# EAGLE schematic wifiaudiolink (EAGLE 9.7.0)
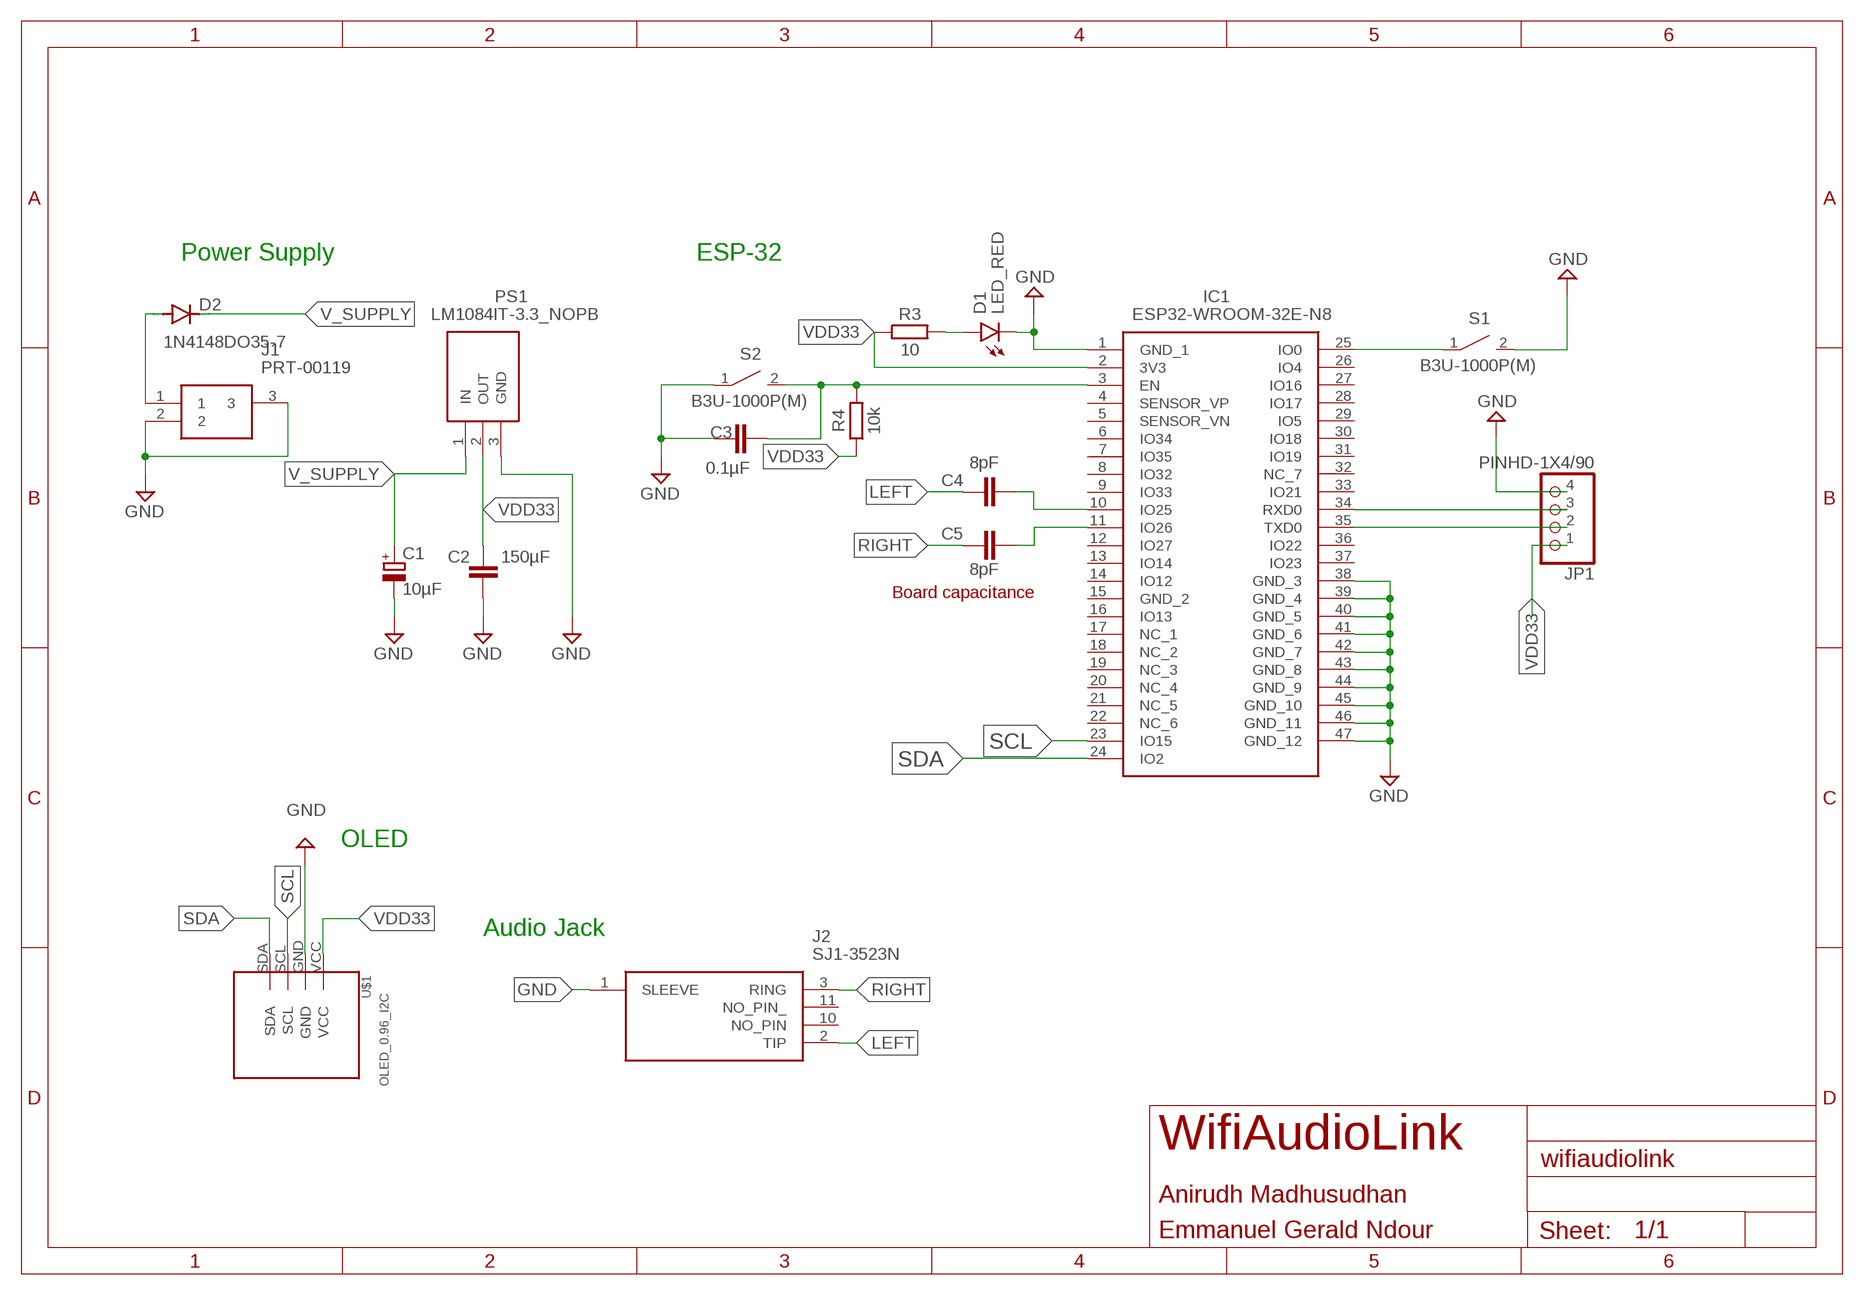
[diagram p0: schematic, sheet 1]

## Parts
C1  10µF  C-POL_RADIAL-11MM-DIA  [CAPPRD508W65D1000H1100B]
C2  150µF  C_RADIAL-12.5MM-DIA  [CAPRD550W60D1025H1250B]
C3  0.1µF  C_CHIP-1812(4532-METRIC)  [CAPC4532X135]
C4  8pF  C_RADIAL-55.5MM-DIA  [CAPRD2261W240D5080H5555B]
C5  8pF  C_RADIAL-55.5MM-DIA  [CAPRD2261W240D5080H5555B]
D1  LED_RED  CHIP-FLAT-R_1206  [LEDC3216X75N_FLAT-R]
D2  1N4148DO35-7  [DO35-7]
IC1  ESP32-WROOM-32E-N8  [ESP32WROOM32EN8]
J1  PRT-00119  [PRT00119]
J2  SJ1-3523N  [SJ13523N]
JP1  PINHD-1X4/90  [1X04/90]
PS1  LM1084IT-3.3_NOPB  [TO254P470X1028X1955-3P]
R3  10  R_CHIP-1206(3216-METRIC)  [RESC3216X70]
R4  10k  R_CHIP-1206(3216-METRIC)  [RESC3216X70]
S1  B3U-1000P(M)  B3U-X000B3U-1000P(M)1000P(M)  [B3U-1000P(M)]
S2  B3U-1000P(M)  B3U-X000B3U-1000P(M)1000P(M)  [B3U-1000P(M)]
U$1  OLED_0.96_I2C  [OLED_0.96_I2C]

## Nets
GND: C1.2(-) C2.2 C3.2 D1.C IC1.1(GND_1) IC1.38(GND_3) IC1.39(GND_4) IC1.40(GND_5) IC1.41(GND_6) IC1.42(GND_7) IC1.43(GND_8) IC1.44(GND_9) IC1.45(GND_10) IC1.46(GND_11) IC1.47(GND_12) J1.2 J1.3 J2.1(SLEEVE) JP1.4 PS1.3(GND) S1.2 S2.1 U$1.GND
LEFT: C4.1 J2.2(TIP)
N$1: IC1.25(IO0) S1.1
N$2: C3.1 IC1.3(EN) R4.2 S2.2
N$3: C4.2 IC1.10(IO25)
N$4: IC1.34(RXD0) JP1.3
N$5: IC1.35(TXD0) JP1.2
N$6: C5.2 IC1.11(IO26)
N$9: D1.A R3.2
N$11: D2.A J1.1
RIGHT: C5.1 J2.3(RING)
SCL: IC1.23(IO15) U$1.SCL
SDA: IC1.24(IO2) U$1.SDA
V_SUPPLY: C1.1(+) D2.C PS1.1(IN)
VDD33: C2.1 IC1.2(3V3) JP1.1 PS1.2(OUT) R3.1 R4.1 U$1.VCC
Unconnected: IC1.4(SENSOR_VP) IC1.5(SENSOR_VN) IC1.6(IO34) IC1.7(IO35) IC1.8(IO32) IC1.9(IO33) IC1.12(IO27) IC1.13(IO14) IC1.14(IO12) IC1.15(GND_2) IC1.16(IO13) IC1.17(NC_1) IC1.18(NC_2) IC1.19(NC_3) IC1.20(NC_4) IC1.21(NC_5) IC1.22(NC_6) IC1.26(IO4) IC1.27(IO16) IC1.28(IO17) IC1.29(IO5) IC1.30(IO18) IC1.31(IO19) IC1.32(NC_7) IC1.33(IO21) IC1.36(IO22) IC1.37(IO23) J2.10(NO_PIN) J2.11(NO_PIN_)

## Notes on the sheet
- Power Supply | ESP-32
- Board capacitance
- OLED
- Audio Jack
- WifiAudioLink
- Anirudh Madhusudhan
- Emmanuel Gerald Ndour

## Library data of the parts
C1 = Capacitor:C-POL: Capacitor Polarised - Generic; CATEGORY: Capacitor
C2 C3 = Capacitor:C: Capacitor - Generic; CATEGORY: Capacitor
C4 C5 = Tutorial - Fusion 360:C: Capacitor - Generic; CATEGORY: Capacitor
D1 = LED:CHIP-FLAT-R; CATEGORY: LED; COLOR: RED; DESCRIPTION: CHIP LED FLAT; SUB-CATEGORY: CHIP; TYPE: FLAT_TOP
D2 = diode:1N4148: DIODE high speed (Philips)
IC1 = ESP32-WROOM-32E-N8:ESP32-WROOM-32E-N8: WiFi Modules - 802.11 SMD Module ESP32-WROOM-32E, ESP32-D0WD-V3, 8 MB SPI flash, PCB antenna Source: Datasheet <https://www.google.com/url?sa=t&rct=j&q=&esrc=s&source=web&cd=&ved=2ahUKEwjLw4ysybv2AhXFzIUKHZUbB64QFnoECCwQAQ&url=https://www.espressif.com/sites/default/files/documentation/esp32-wroom-32e_esp32-wroom-32ue_datasheet_en.pdf&usg=AOvVaw1xSL>; DESCRIPTION: WiFi Modules - 802.11 SMD Module ESP32-WROOM-32E, ESP32-D0WD-V3, 8 MB SPI flash, PCB antenna; HEIGHT: 3.25mm; MANUFACTURER_NAME: Espressif Systems; MANUFACTURER_PART_NUMBER: ESP32-WROOM-32E-N8; MOUSER_PART_NUMBER: 356-ESP32WRM32E164PH; MOUSER_PRICE-STOCK: https://www.mouser.co.uk/ProductDetail/Espressif-Systems/ESP32-WROOM-32E-N8?qs=Li%252BoUPsLEnsLnZW%252BGLgUhw%3D%3D
J1 = PRT-00119:PRT-00119: SparkFun Accessories DC Barrel Power Jack/Connector Source: Datasheet <https://www.sparkfun.com/datasheets/Prototyping/Barrel-Connector-PJ-202A.pdf>; DESCRIPTION: SparkFun Accessories DC Barrel Power Jack/Connector; HEIGHT: 11mm; MANUFACTURER_NAME: SparkFun; MANUFACTURER_PART_NUMBER: PRT-00119; MOUSER_PART_NUMBER: 474-PRT-00119; MOUSER_PRICE-STOCK: https://www.mouser.co.uk/ProductDetail/SparkFun/PRT-00119?qs=WyAARYrbSnbnQpS9xf%252Bx5A%3D%3D
J2 = SJ1-3523N:SJ1-3523N: Phone Connectors 3.5 MM AUDIO JACK Source: Datasheet <https://componentsearchengine.com/Datasheets/1/SJ1-3523N.pdf>; DESCRIPTION: Phone Connectors 3.5 MM AUDIO JACK; HEIGHT: 5.5mm; MANUFACTURER_NAME: CUI Devices; MANUFACTURER_PART_NUMBER: SJ1-3523N; MOUSER_PART_NUMBER: 490-SJ1-3523N; MOUSER_PRICE-STOCK: https://www.mouser.co.uk/ProductDetail/CUI-Devices/SJ1-3523N?qs=WyjlAZoYn50aNl0vAhb3Tg%3D%3D
JP1 = Connector:PINHD-1X4: PIN HEADER; CATEGORY: Headers; DESCRIPTION: Header, Right Angle, 4 Position; MANUFACTURER: Generic; MPN: Generic; OPERATING_TEMPERATURE: Generic; PART_STATUS: Active; PITCH: 0.100" (2.54mm); ROHS_COMPLIANCE: Generic; SERIES: Generic; SUB-CATEGORY: Headers, Male Pins; TYPE: Board to Board or Cable, Unshrouded, Through Hole, Right Angle
PS1 = LM1084IT-3.3_NOPB:LM1084IT-3.3_NOPB: Texas Instruments LM1084IT-3.3/NOPB, LDO Voltage Regulator, 5A, 3.3 V, 2.6 27 Vin 3-Pin, TO-220 Source: Datasheet; DESCRIPTION: Texas Instruments LM1084IT-3.3/NOPB, LDO Voltage Regulator, 5A, 3.3 V, 2.6 27 Vin 3-Pin, TO-220; HEIGHT: 4.7mm; MANUFACTURER_NAME: Texas Instruments; MANUFACTURER_PART_NUMBER: LM1084IT-3.3/NOPB; MOUSER_PART_NUMBER: 926-LM1084IT-3.3NOPB; MOUSER_PRICE-STOCK: https://www.mouser.co.uk/ProductDetail/Texas-Instruments/LM1084IT-3.3-NOPB?qs=X1J7HmVL2ZH4e8i30AZoWw%3D%3D
R3 R4 = Resistor:R: Resistor Fixed - Generic; CATEGORY: Resistor; SUB-CATEGORY: Fixed
S1 S2 = Switch:B3U-X000: Ultra-small Tactile Switch Contact form : SPST-NO Datasheet <https://omronfs.omron.com/en_US/ecb/products/pdf/en-b3u.pdf>; CATEGORY: SWITCH; DESCRIPTION: Ultra-small Surface-mounting Tactile Switches with High Contact Reliability; MANUFACTURER: OMRON; OPERATING_TEMPERATURE: -25°C to +70°C at 60%RH max; PART_STATUS: ACTIVE; ROHS_COMPLIANCE: RoHS Compliant; SERIES: B3U; TYPE: Tactile
U$1 = tft_1_8_1_44_oled_0_96:OLED_0.96_I2C